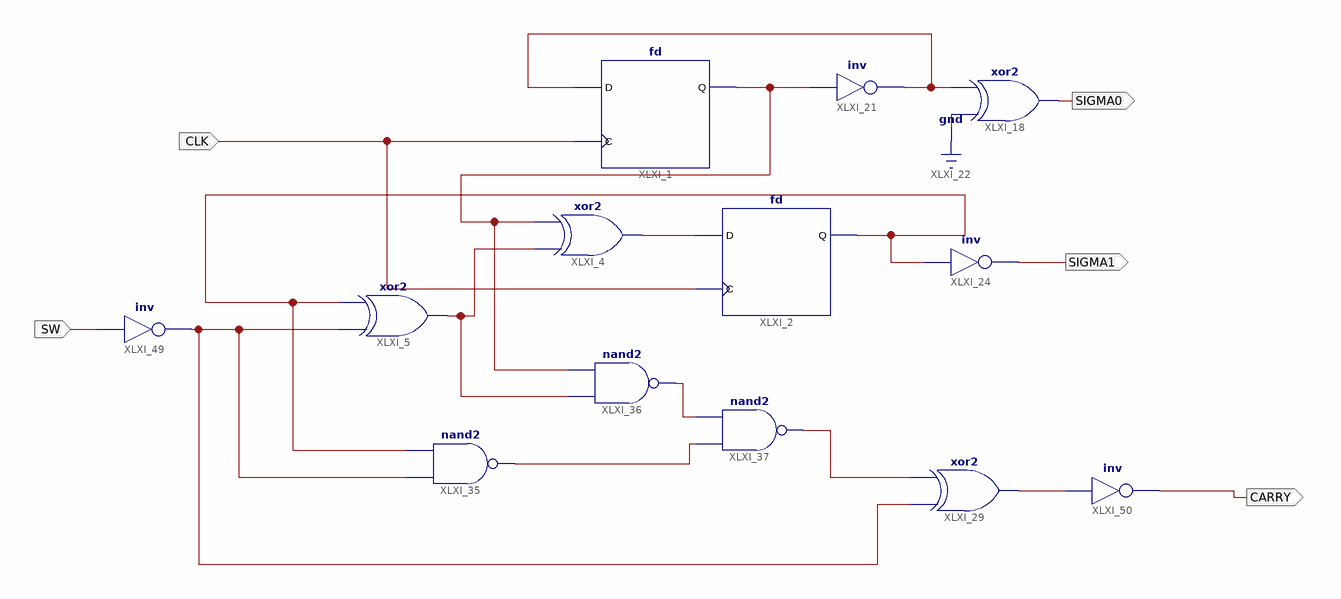
[diagram p0: schematic sheet 1]
// Xilinx ISE schematic UPDOWN_CNT2_途中経過.sch (spartan6) as structural Verilog: 13 symbols, 5 ports
module \UPDOWN_CNT2_途中経過  (
  input  CLK,
  input  SW,
  output CARRY,
  output SIGMA0,
  output SIGMA1
);

  wire b, SI, SIG, XLXN_5, XLXN_12, XLXN_13, XLXN_33, XLXN_68, XLXN_79, XLXN_104;

  fd XLXI_2 (.C(CLK), .D(XLXN_5), .Q(SIG));
  xor XLXI_4 (XLXN_5, XLXN_33, SI);
  xor XLXI_5 (XLXN_33, b, SIG);
  fd XLXI_1 (.C(CLK), .D(XLXN_68), .Q(SI));
  xor XLXI_18 (SIGMA0, 1'b0, XLXN_68);
  not XLXI_21 (XLXN_68, SI);
  xor XLXI_29 (XLXN_104, b, XLXN_79);
  nand XLXI_35 (XLXN_13, b, SIG);
  nand XLXI_36 (XLXN_12, XLXN_33, SI);
  nand XLXI_37 (XLXN_79, XLXN_13, XLXN_12);
  not XLXI_24 (SIGMA1, SIG);
  not XLXI_49 (b, SW);
  not XLXI_50 (CARRY, XLXN_104);
endmodule
